# Altium schematic sheet PythonOrC_HAB__CosmicRayHAB__CosmicWatchMain.SchDoc
size A4
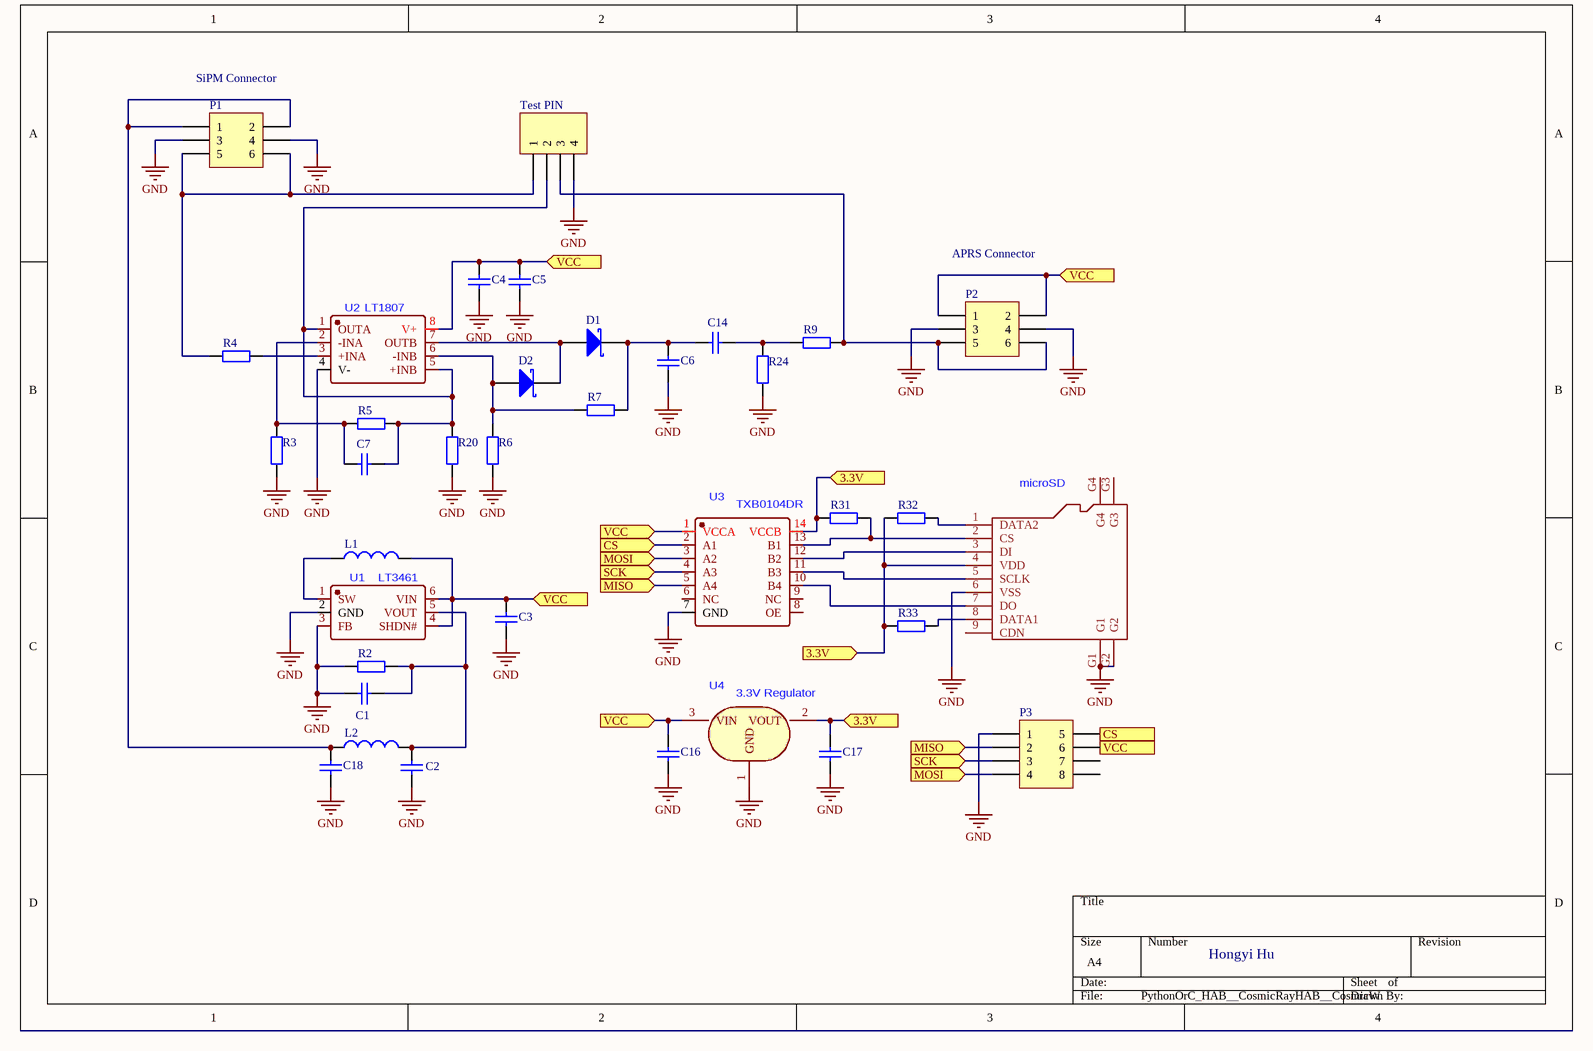
[diagram p0: PythonOrC_HAB__CosmicRayHAB__CosmicWatchMain.SchDoc]

## Parts
C1  Cap  [RAD-0.3]  (value not drawn)
C2  Cap  [RAD-0.3]  (value not drawn)
C3  Cap  [RAD-0.3]  (value not drawn)
C4  Cap  [RAD-0.3]  (value not drawn)
C5  Cap  [RAD-0.3]  (value not drawn)
C6  Cap  [RAD-0.3]  (value not drawn)
C7  Cap  [RAD-0.3]  (value not drawn)
C14  Cap  [RAD-0.3]  (value not drawn)
C16  Cap  [RAD-0.3]  (value not drawn)
C17  Cap  [RAD-0.3]  (value not drawn)
C18  Cap  [RAD-0.3]  (value not drawn)
D1  Diode 10TQ035  [TO-220AC]  (value not drawn)
D2  Diode 10TQ035  [TO-220AC]  (value not drawn)
L1  Inductor  [0402-A]  (value not drawn)
L2  Inductor  [0402-A]  (value not drawn)
microSD  (no value)  [MICRO-SD9+4P-SMD-16.1X14.5X1.85MM]
P1  SiPM Connector  [MHDR2X3]
P2  APRS Connector  [MHDR2X3]
P3  Header 4X2A  [HDR2X4_CEN]  (value not drawn)
R2  Res2  [AXIAL-0.4]  (value not drawn)
R3  Res2  [AXIAL-0.4]  (value not drawn)
R4  Res2  [AXIAL-0.4]  (value not drawn)
R5  Res2  [AXIAL-0.4]  (value not drawn)
R6  Res2  [AXIAL-0.4]  (value not drawn)
R7  Res2  [AXIAL-0.4]  (value not drawn)
R9  Res2  [AXIAL-0.4]  (value not drawn)
R20  Res2  [AXIAL-0.4]  (value not drawn)
R24  Res2  [AXIAL-0.4]  (value not drawn)
R31  Res2  [AXIAL-0.4]  (value not drawn)
R32  Res2  [AXIAL-0.4]  (value not drawn)
R33  Res2  [AXIAL-0.4]  (value not drawn)
Test_PIN  Header 4H  [HDR1X4H]  (value not drawn)
U1  LT3461  [TSOT-23-6_L2.9-W1.6-P0.95-LS2.8-BL]
U2  LT1807  [SOIC-8_L5.0-W4.0-P1.27-LS6.0-BL]
U3  TXB0104DR  [SOIC-14_L8.7-W3.9-P1.27-LS6.0-BL]
U4  3.3V Regulator  [SOT-23]

## Ports
3.3V (in), CS (in), MISO (in), MOSI (in), SCK (in), VCC (in)

## Nets
GND: C1.1 C2.1 C3.1 C4.1 C5.1 C6.1 C16.1 C17.1 C18.1 microSD.6(VSS) microSD.G1 microSD.G2 P1.3 P1.4 P2.3 P2.4 P3.1 R2.1 R3.1 R6.1 R20.1 R24.1 Test_PIN.4 U1.2(GND) U1.3(FB) U2.4(V-) U3.7(GND) U4.1(GND)
3.3V: C17.2 microSD.4(VDD) R31.1 R32.1 R33.1 U3.14(VCCB) U4.2(VOUT) ; port 3.3V
CS: P3.5 U3.2(A1) ; port CS
MISO: P3.2 U3.5(A4) ; port MISO
MOSI: P3.4 U3.3(A2) ; port MOSI
SCK: P3.3 U3.4(A3) ; port SCK
VCC: C3.2 C4.2 C5.2 C16.2 L1.2 P2.1 P2.2 P3.6 U1.4(SHDN#) U1.6(VIN) U2.8(V+) U3.1(VCCA) U4.3(VIN) ; port VCC
NetC1_2: C1.2 C2.2 L2.2 R2.2 U1.5(VOUT)
NetC6_2: C6.2 C14.1 D1.1(K) R7.2
NetC7_1: C7.1 R3.2 R5.1 U2.2(-INA)
NetC7_2: C7.2 R5.2 R20.2 Test_PIN.2 U2.1(OUTA) U2.5(+INB)
NetC14_2: C14.2 R9.1 R24.2
NetC18_2: C18.2 L2.1 P1.1 P1.2
NetD1_3: D1.3(A) D2.1(K) U2.7(OUTB)
NetD2_3: D2.3(A) R6.2 R7.1 U2.6(-INB)
NetL1_1: L1.1 U1.1(SW)
NetmicroSD_1: microSD.1(DATA2) R32.2
NetmicroSD_2: microSD.2(CS) R31.2 U3.13(B1)
NetmicroSD_3: microSD.3(DI) U3.12(B2)
NetmicroSD_5: microSD.5(SCLK) U3.11(B3)
NetmicroSD_7: microSD.7(DO) U3.10(B4)
NetmicroSD_8: microSD.8(DATA1) R33.2
NetP1_5: P1.5 P1.6 R4.1 Test_PIN.1
NetP2_5: P2.5 P2.6 R9.2 Test_PIN.3
NetR4_2: R4.2 U2.3(+INA)

Not connected (* = marked no-connect by the designer): microSD 9(CDN) G3 G4; P3 7 8; U3 6(NC) 8(OE) 9(NC)

## Notes on the sheet
- Hongyi Hu

## Library data of the parts
C1-C7 C14 C16-C18 = Cap: Capacitor; Value: 100pF; Published: 8-Jun-2000; LatestRevisionDate: 17-Jul-2002; LatestRevisionNote: Re-released for DXP Platform.; PackageReference: RAD-0.3; Publisher: Altium Limited; PackageDescription: Radial Cap, Thru-Hole; 2 Leads; 0.3 in Pin Spacing
D1 D2 = Diode 10TQ035: Schottky Rectifier; Note: Terminal 2 is the TAB and is electrically connected to the cathode; Published: 8-Jun-2000; LatestRevisionDate: 17-Jul-2002; LatestRevisionNote: Re-released for DXP Platform.; DatasheetVersion: PD-2.057B; PackageVersion: Feb-1998; PackageReference: TO-220AC; Publisher: Altium Limited; PackageDescription: TO, Thru-Hole, Vertical, Heatsink Mounted; 3 In-Line Leads (1 Absent); Pitch 2.54 mm; ComponentLink1Description: Manufacturer Link; ComponentLink1URL: http://www.irf.com/; ComponentLink2Description: Datasheet; ComponentLink2URL: http://www.irf.com/product-info/datasheets/data/10tq.pdf
L1 L2 = Inductor: Code_IEC: 1005; Value: 10mH; Published: 8-Jun-2000; LatestRevisionDate: 29-May-2009; LatestRevisionNote: IPC-7351 Footprint Added.; PackageReference: 0402-A; Publisher: Altium Limited; PackageDescription: Chip Inductor; Code_JEITA: 0402
microSD = Micro SD Card Holder;
P1 P2 = MHDR2X3: Header, 3-Pin, Dual row; LatestRevisionDate: 17-Jul-2002; LatestRevisionNote: Re-released for DXP Platform.; Publisher: Altium Limited
P3 = Header 4X2A: Header, 4-Pin, Dual row; LatestRevisionDate: 17-Jul-2002; LatestRevisionNote: Re-released for DXP Platform.; Publisher: Altium Limited
R2-R7 R9 R20 R24 R31-R33 = Res2: Resistor; Value: 1K; Published: 8-Jun-2000; LatestRevisionDate: 17-Jul-2002; LatestRevisionNote: Re-released for DXP Platform.; PackageReference: AXIAL-0.4; Publisher: Altium Limited; PackageDescription: Axial Device, Thru-Hole; 2 Leads; 0.4 in Pin Spacing
Test_PIN = Header 4H: Header, 4-Pin, Right Angle; LatestRevisionDate: 17-Jul-2002; LatestRevisionNote: Re-released for DXP Platform.; Publisher: Altium Limited
U1 = LT3461AES6#TRPBF
U2 = LT1807CS8#PBF
U4 = AP2138N-3.3